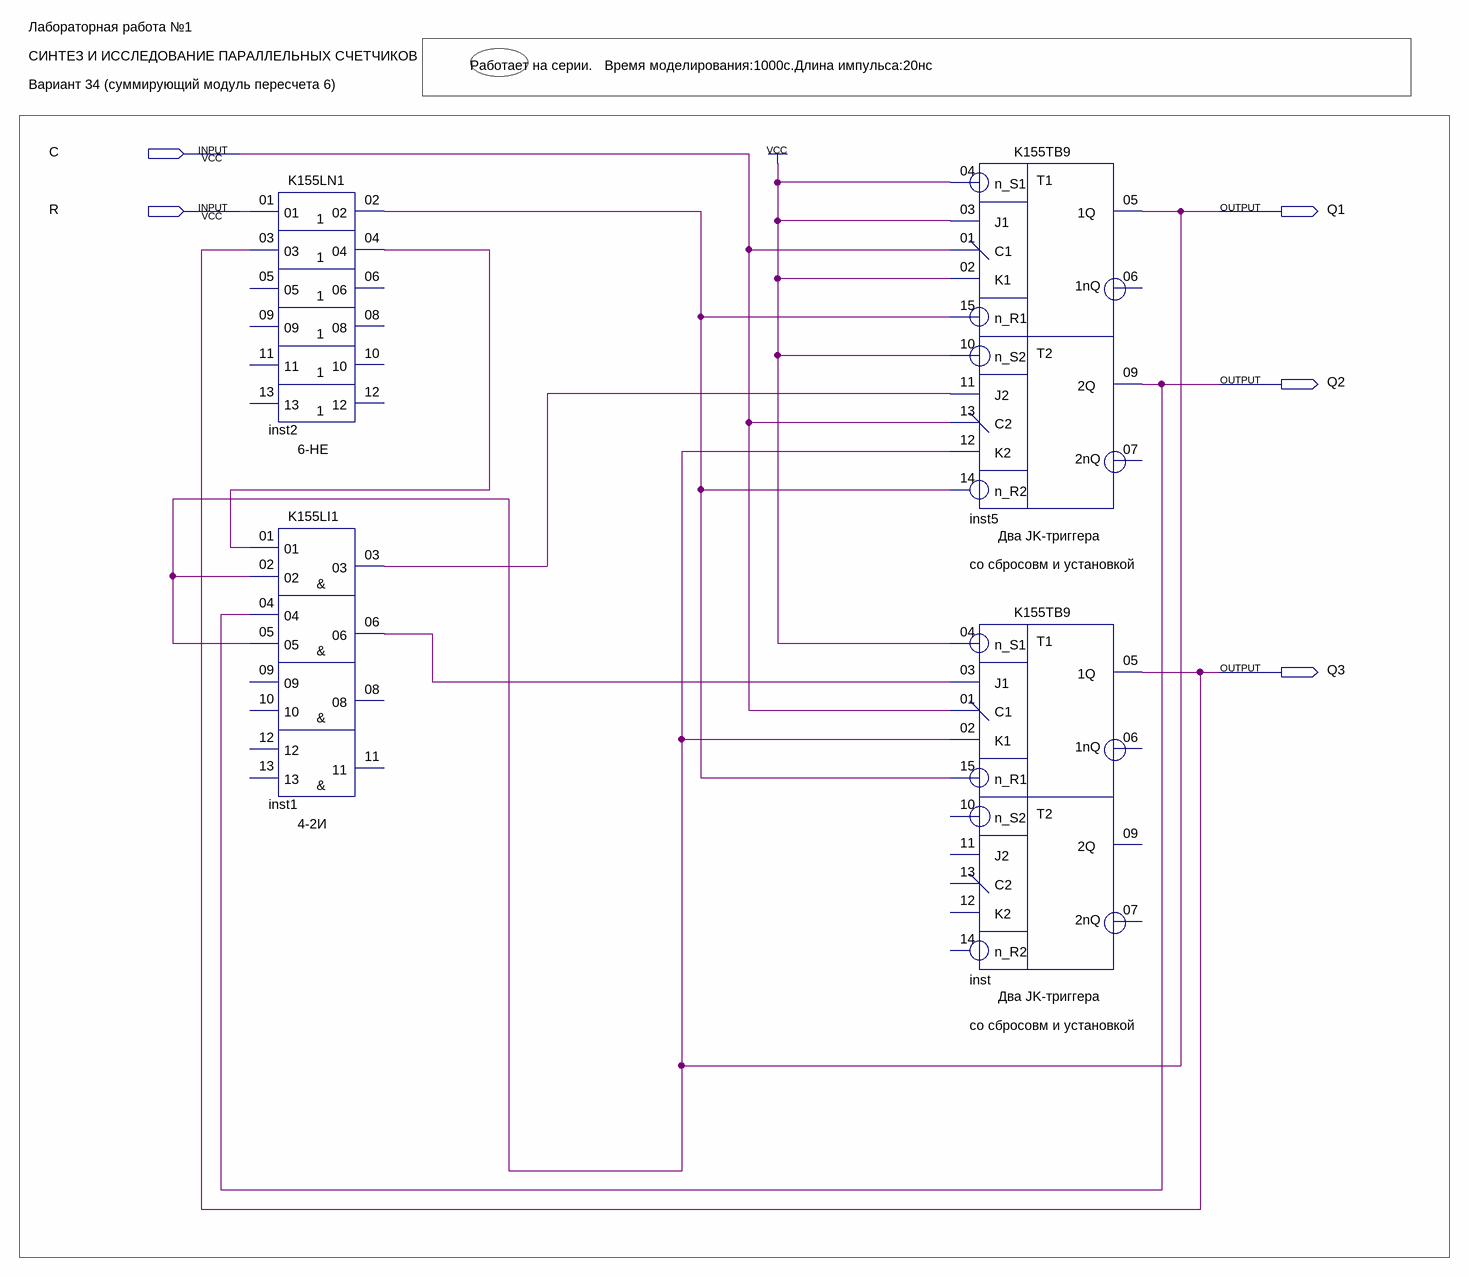
[diagram p0: schematic sheet]
// Quartus schematic 1_lab.bdf as structural Verilog: 4 symbols, 5 pins
module \1_lab  (
  input  C,
  input  R,
  output Q1,
  output Q2,
  output Q3
);

  wire inst1_03, inst1_06, inst2_02, inst2_04;

  K155LN1 inst2 (.\01 (R), .\03 (Q3), .\02 (inst2_02), .\04 (inst2_04));  // open: 05, 09, 11, 13, 06, 08, 10, 12
  K155LI1 inst1 (
    .\01 (inst2_04), .\02 (Q1), .\04 (Q2), .\05 (Q1), .\03 (inst1_03), .\06 (inst1_06));  // open: 09, 10, 12, 13, 08, 11
  K155TB9 inst5 (
    .n_S1(1'b1), .J1(1'b1), .n_R1(inst2_02), .C1(C), .K1(1'b1), .n_S2(1'b1), .J2(inst1_03), .n_R2(inst2_02),
    .C2(C), .K2(Q1), .\1Q (Q1), .\2Q (Q2));  // open: 1nQ, 2nQ
  K155TB9 inst (
    .n_S1(1'b1), .J1(inst1_06), .n_R1(inst2_02), .C1(C), .K1(Q1), .\1Q (Q3));  // open: n_S2, J2, n_R2, C2, K2, 1nQ, 2Q, 2nQ

  // Notes on the sheet:
  //   Лабораторная работа №1
  //   СИНТЕЗ И ИССЛЕДОВАНИЕ ПАРАЛЛЕЛЬНЫХ СЧЕТЧИКОВ
  //   Работает на серии.   Время моделирования:1000с.Длина импульса:20нс
  //   Вариант 34 (суммирующий модуль пересчета 6)
endmodule
